# EAGLE design circuit (EAGLE 7.1.0)
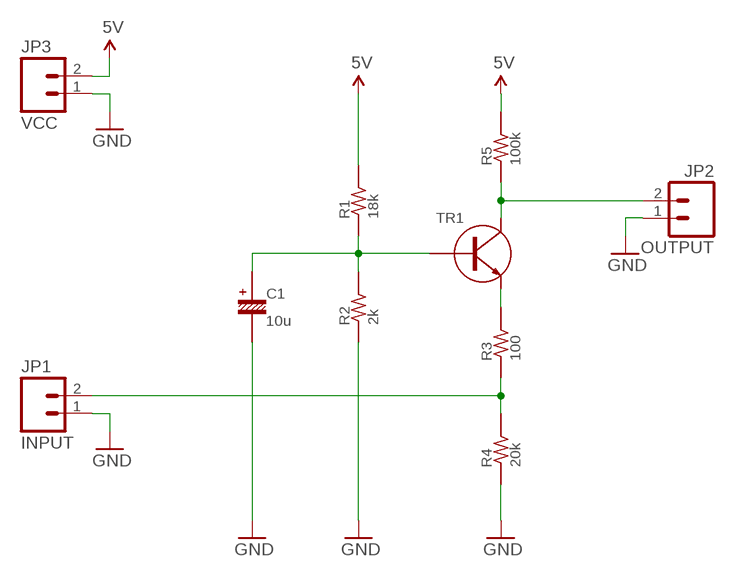
[diagram p0: schematic, sheet 1]

## Parts
C1  10u  CE-16V-04-2.54  [16V-4-2.54]
JP1  INPUT  M02PTH  [1X02]
JP2  OUTPUT  M02PTH  [1X02]
JP3  VCC  M02PTH  [1X02]
R1  18k  R-1/4W-07.62  [1/4W-7.62H]
R2  2k  R-1/4W-07.62  [1/4W-7.62H]
R3  100  R-1/4W-07.62  [1/4W-7.62H]
R4  20k  R-1/4W-07.62  [1/4W-7.62H]
R5  100k  R-1/4W-07.62  [1/4W-7.62H]
TR1  TR-NPN-TO-92-ECB  [TO-92]

## Nets
5V: JP3.2 R1.PAD2 R5.PAD2
GND: C1.- JP1.1 JP2.1 JP3.1 R2.PAD1 R4.PAD1
N$1: JP2.2 R5.PAD1 TR1.2(C)
N$2: R3.PAD2 TR1.1(E)
N$3: JP1.2 R3.PAD1 R4.PAD2
N$4: C1.+ R1.PAD1 R2.PAD2 TR1.3(B)

## Library data of the parts
C1 = my:CE-: ELECTROLYTIC CAPACITOR Japanese symbol
JP1-JP3 = SparkFun-Connectors:M02: Header 2 Standard 2-pin 0.1" header. Use with straight break away headers (SKU : PRT-00116), right angle break away headers (PRT-00553), swiss pins (PRT-00743), machine pins (PRT-00117), and female headers (PRT-00115). Molex polarized connector foot print use with SKU : PRT-08233 with associated crimp pins and housings.
R1-R5 = my:R-: RESISTOR Japanese symbol
TR1 = my:TR-NPN-: TRANSISTOR (Bipolar transistor) NPN type Japanese symbol

## Board
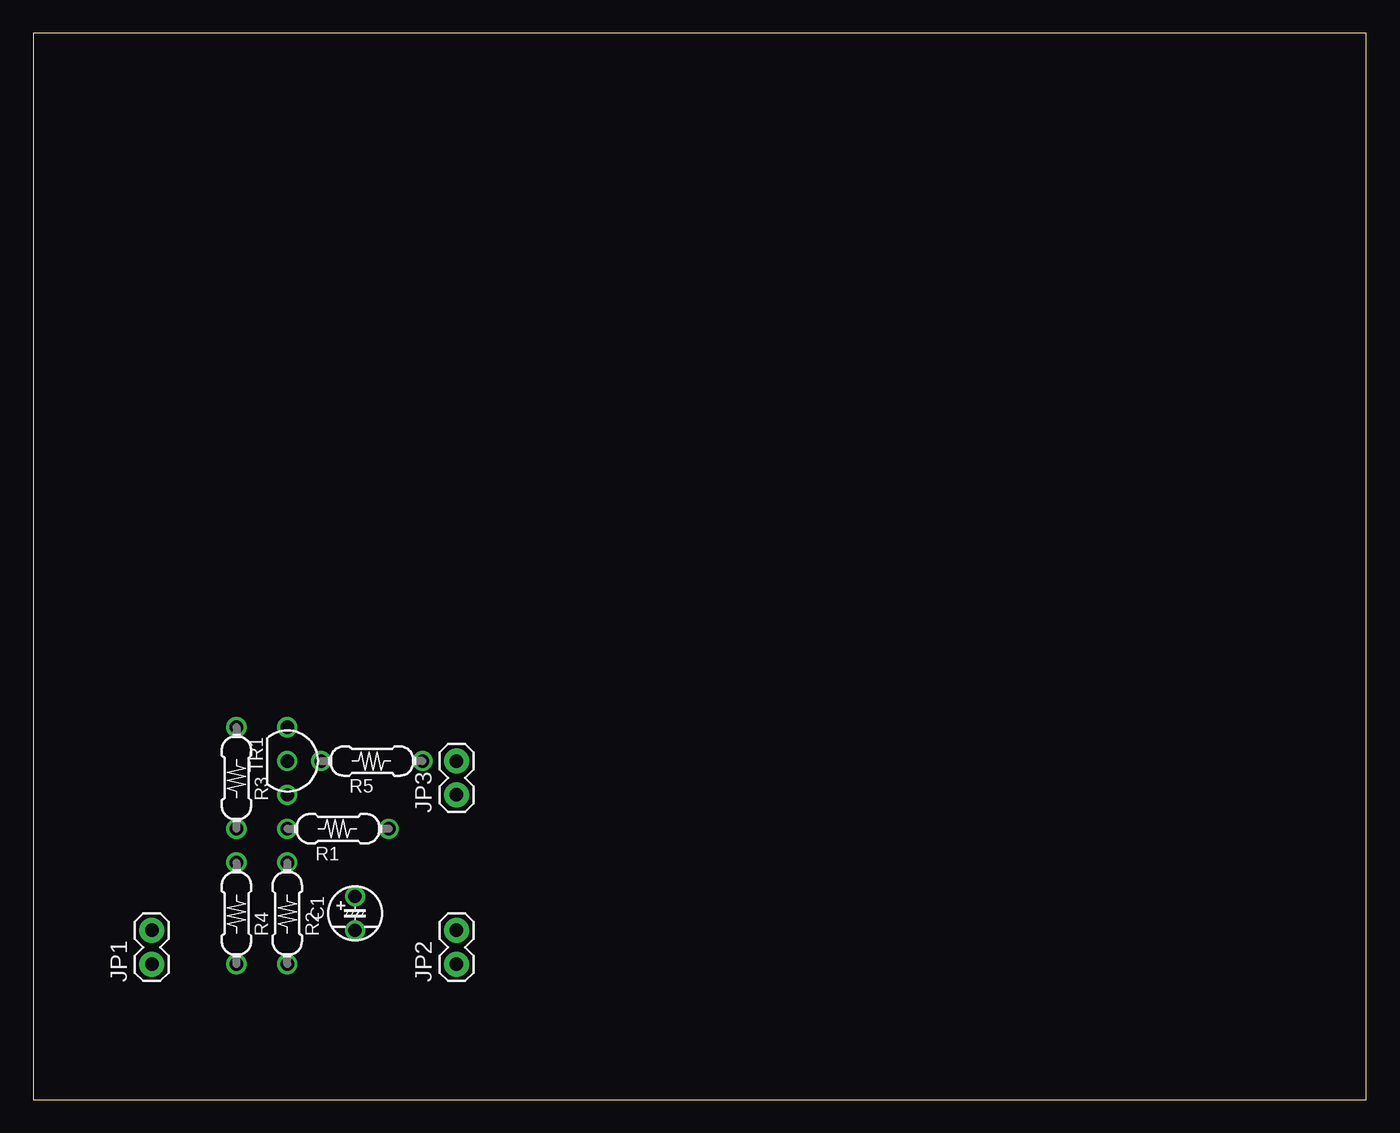
[diagram p1: board, top side]
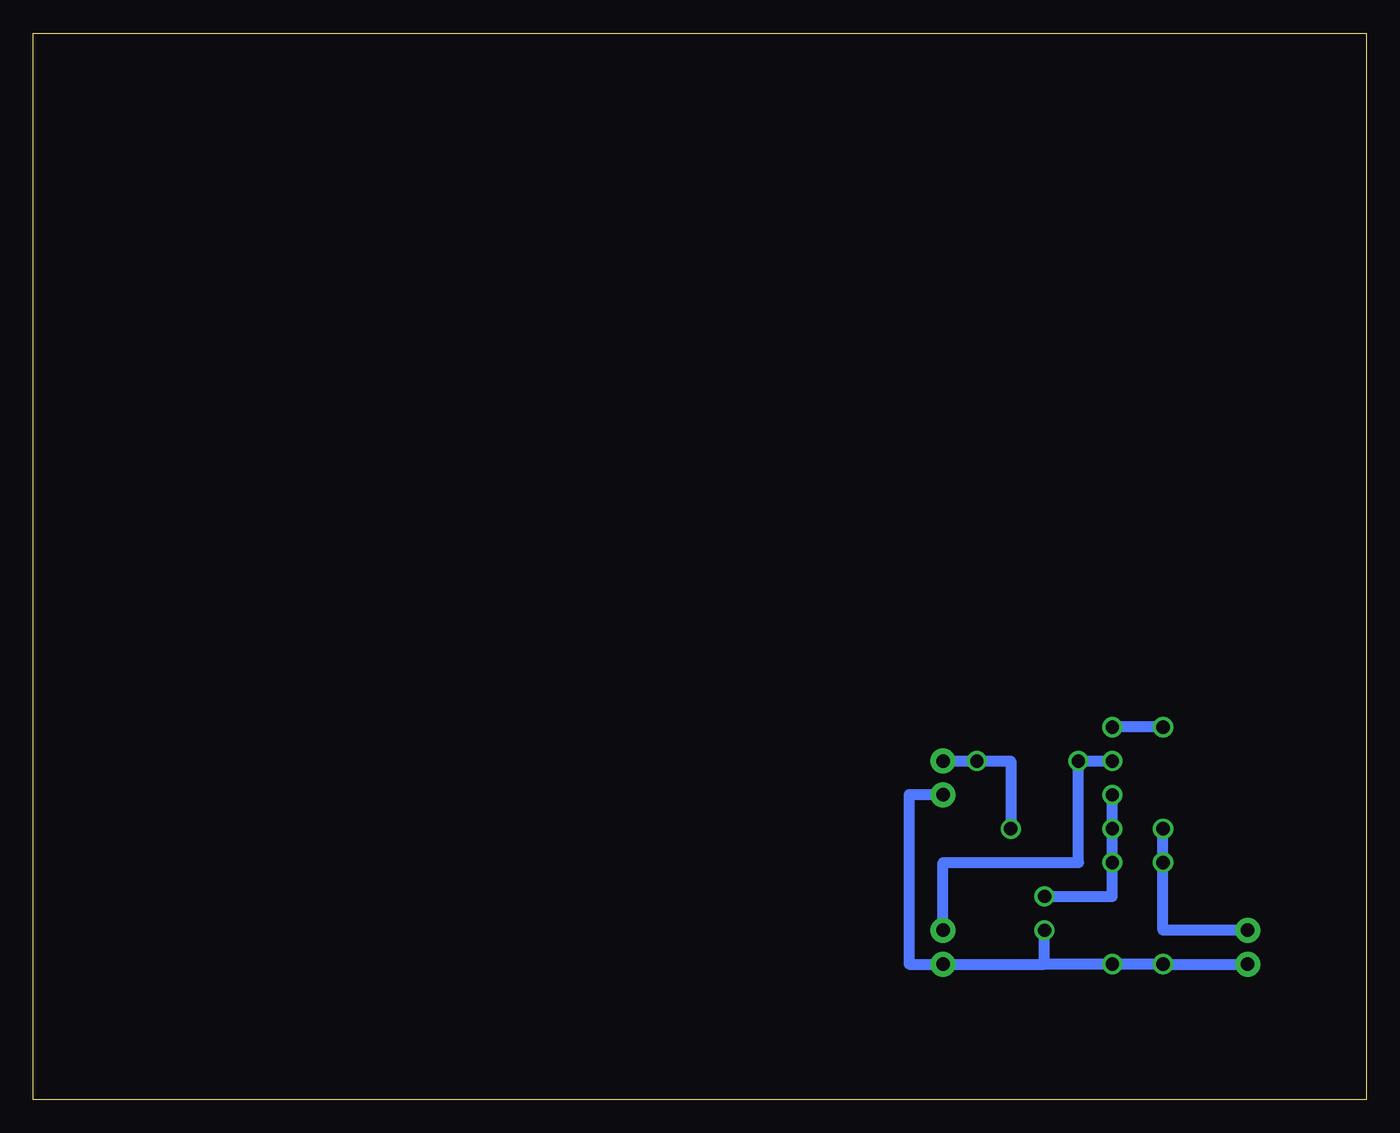
[diagram p2: board, bottom side, seen from below]

Size 100 x 80 mm. Coordinates in mm from the lower left corner, seen from the top.
Outline: 0,0 100,0 100,80 0,80 0,0
Copper layers (1*16): Top 0.035mm / dielectric 1.5mm / Bottom 0.035mm
Design rules "default": minimum track width 10mil, minimum drill 24mil, track to track 8mil, track to pad 8mil, pad to pad 8mil, via to via 8mil, smd to smd 8mil, copper to edge 40mil, drill to drill 8mil, minimum pad ring 10mil, minimum via ring 8mil, stop-mask expansion 4mil, vias tented up to drill 0mil, thermal gap 10mil

### Footprints (pad centres in the part's own frame; a part is rotated, then mirrored left to right if it is on the bottom)
16V-4-2.54 = drill 1: + -1.27,0; - 1.27,0
1X02 = drill 1.016 pad 1.88: 1 0,0; 2 2.54,0
1/4W-7.62H = drill 1: PAD1 -3.81,0; PAD2 3.81,0
TO-92 = drill 1: 1 -2.54,0; 2 0,0; 3 2.54,0

### Placement (x,y rotation side)
C1  24.13,13.97 270 top
JP1  8.89,10.16 90 top
JP2  31.75,10.16 90 top
JP3  31.75,22.86 90 top
R1  22.86,20.32 0 top
R2  19.05,13.97 90 top
R3  15.24,24.13 90 top
R4  15.24,13.97 90 top
R5  25.4,25.4 0 top
TR1  19.05,25.4 270 top

### Tracks (layer width: path | path; a pad name or v marks a point on that pad's centre or on a via)
5V
  Bottom 0.813: JP3.2 R5.PAD2 26.67,25.4 R1.PAD2
GND
  Bottom 0.813: JP1.1 R4.PAD1 R2.PAD1 24.13,10.16 | 24.13,10.16 C1.- | 24.13,10.16 JP2.1 34.29,10.16 34.29,22.86 JP3.1
N$1
  Bottom 0.813: JP2.2 31.75,17.78 21.59,17.78 R5.PAD1 TR1.2
N$2
  Bottom 0.813: R3.PAD2 TR1.1
N$3
  Bottom 0.813: JP1.2 15.24,12.7 R4.PAD2 R3.PAD1
N$4
  Bottom 0.813: TR1.3 R1.PAD1 R2.PAD2 19.05,15.24 C1.+